# EAGLE schematic Dual Stepper Control Board (EAGLE 8.1.0)
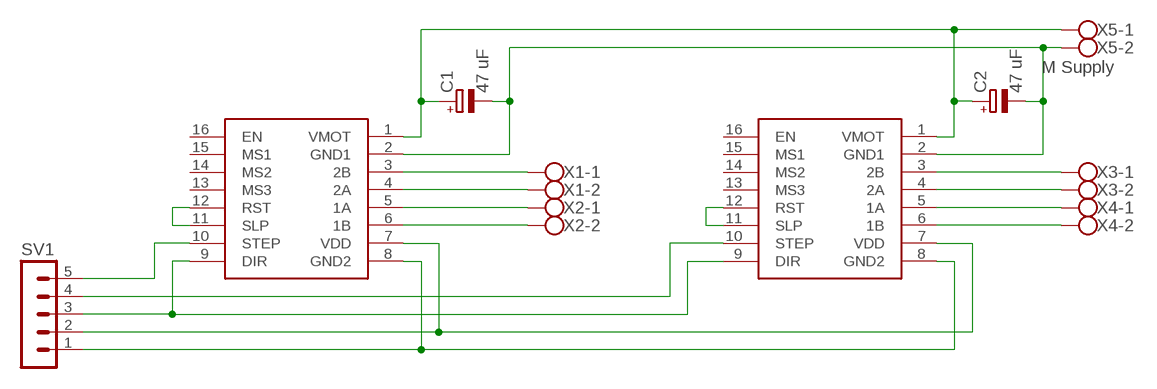
[diagram p0: schematic, sheet 1]

## Parts
C1  47 uF  CPOL-EUE3.5-8  [E3,5-8]
C2  47 uF  CPOL-EUE3.5-8  [E3,5-8]
SV1  MA05-1  [MA05-1]
U$1  POLOLUESTEPPERDRIVER  [DIL16]
U$2  POLOLUESTEPPERDRIVER  [DIL16]
X1  W237-102  [W237-102]
X2  W237-102  [W237-102]
X3  W237-102  [W237-102]
X4  W237-102  [W237-102]
X5  M Supply  W237-102  [W237-102]

## Nets
N$1: U$1.3(2B) X1.1
N$2: U$1.4(2A) X1.2
N$3: U$1.5(1A) X2.1
N$4: U$1.6(1B) X2.2
N$5: U$2.3(2B) X3.1
N$6: U$2.4(2A) X3.2
N$7: U$2.5(1A) X4.1
N$8: U$2.6(1B) X4.2
N$9: U$1.11(SLP) U$1.12(RST)
N$10: U$2.11(SLP) U$2.12(RST)
N$11: SV1.4 U$2.10(STEP)
N$12: C1.+ C2.+ U$1.1(VMOT) U$2.1(VMOT) X5.1
N$13: SV1.3 U$1.9(DIR) U$2.9(DIR)
N$14: SV1.2 U$1.7(VDD) U$2.7(VDD)
N$15: C1.- C2.- U$1.2(GND1) U$2.2(GND1) X5.2
N$16: SV1.1 U$1.8(GND2) U$2.8(GND2)
N$18: SV1.5 U$1.10(STEP)
Unconnected: U$1.13(MS3) U$1.14(MS2) U$1.15(MS1) U$1.16(EN) U$2.13(MS3) U$2.14(MS2) U$2.15(MS1) U$2.16(EN)

## Library data of the parts
C1 C2 = rcl:CPOL-EU: POLARIZED CAPACITOR, European symbol
SV1 = con-lstb:MA05-1: PIN HEADER; OC_FARNELL: unknown; OC_NEWARK: unknown
U$1 U$2 = reprap:POLOLUESTEPPERDRIVER: Pololu stepper driver based on the A4983.
X1-X5 = con-wago-500:W237-102: WAGO SCREW CLAMP; MPN: 237-102; OC_FARNELL: unknown; OC_NEWARK: 70K9898